# Altium schematic sheet LED Channels.SchDoc
size A4; Revision: 0; SheetNumber: 2; SheetTotal: 12; ProjectName: Repeated Channels
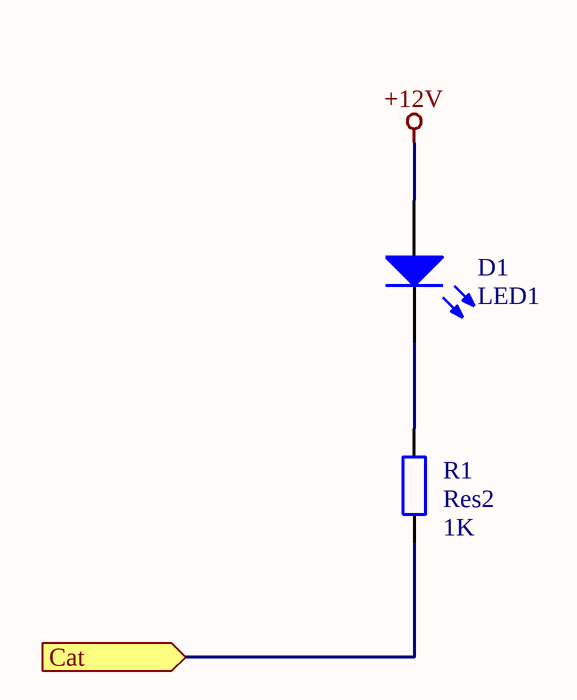
[diagram p0: LED Channels.SchDoc]

## Parts
D1  LED1  [LED-1]
R1  Res2  value 1K  [AXIAL-0.4]

## Ports
Cat (in)

## Nets
+12V: D1.1(A)
Cat: R1.1 ; port Cat
NetD1_2: D1.2(K) R1.2

## Library data of the parts
D1 = LED1: Typical RED GaAs LED; Published: 8-Jun-2000; LatestRevisionDate: 08-Jul-2005; LatestRevisionNote: Mech Layer 1 removed.; PackageReference: LED-1; Publisher: Altium Limited; PackageDescription: LED; 2 Leads
R1 = Res2: Resistor; Published: 8-Jun-2000; LatestRevisionDate: 17-Jul-2002; LatestRevisionNote: Re-released for DXP Platform.; PackageReference: AXIAL-0.4; Publisher: Altium Limited; PackageDescription: Axial Device, Thru-Hole; 2 Leads; 0.4 in Pin Spacing